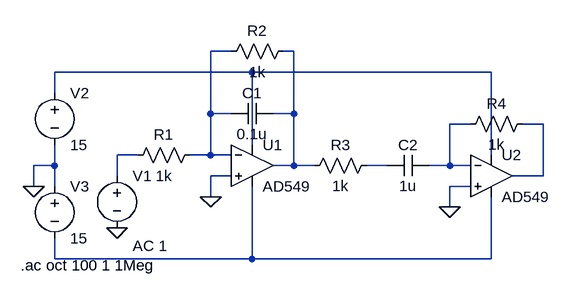
[diagram p0: schematic BandPassFilter2.asc]
BandPassFilter2.asc, the LTspice schematic file:
Version 4
SHEET 1 880 680
WIRE 240 -16 208 -16
WIRE 336 -16 320 -16
WIRE 272 16 -32 16
WIRE 640 16 272 16
WIRE -32 48 -32 16
WIRE 208 80 208 -16
WIRE 240 80 208 80
WIRE 336 80 336 -16
WIRE 336 80 304 80
WIRE 608 96 576 96
WIRE 720 96 688 96
WIRE 272 128 272 16
WIRE 96 144 64 144
WIRE 208 144 208 80
WIRE 208 144 176 144
WIRE 240 144 208 144
WIRE 640 144 640 16
WIRE -32 160 -32 128
WIRE -32 160 -64 160
WIRE 336 160 336 80
WIRE 336 160 304 160
WIRE 368 160 336 160
WIRE 480 160 448 160
WIRE 576 160 576 96
WIRE 576 160 544 160
WIRE 608 160 576 160
WIRE 64 176 64 144
WIRE 240 176 208 176
WIRE 720 176 720 96
WIRE 720 176 672 176
WIRE -64 192 -64 160
WIRE -32 192 -32 160
WIRE 608 192 576 192
WIRE 208 208 208 176
WIRE 576 224 576 192
WIRE -32 304 -32 272
WIRE 272 304 272 192
WIRE 272 304 -32 304
WIRE 640 304 640 208
WIRE 640 304 272 304
FLAG -64 192 0
FLAG 64 256 0
FLAG 208 208 0
FLAG 576 224 0
SYMBOL voltage 64 160 R0
WINDOW 123 24 124 Left 2
WINDOW 39 0 0 Left 0
SYMATTR InstName V1
SYMATTR Value ""
SYMATTR Value2 AC 1
SYMBOL voltage -32 32 R0
WINDOW 123 0 0 Left 0
WINDOW 39 0 0 Left 0
SYMATTR InstName V2
SYMATTR Value 15
SYMBOL voltage -32 176 R0
WINDOW 123 0 0 Left 0
WINDOW 39 0 0 Left 0
SYMATTR InstName V3
SYMATTR Value 15
SYMBOL Opamps\\AD549 272 96 R0
SYMATTR InstName U1
SYMBOL Opamps\\AD549 640 112 R0
SYMATTR InstName U2
SYMBOL res 192 128 R90
WINDOW 0 0 56 VBottom 2
WINDOW 3 32 56 VTop 2
SYMATTR InstName R1
SYMATTR Value 1k
SYMBOL res 336 -32 R90
WINDOW 0 0 56 VBottom 2
WINDOW 3 32 56 VTop 2
SYMATTR InstName R2
SYMATTR Value 1k
SYMBOL res 464 144 R90
WINDOW 0 0 56 VBottom 2
WINDOW 3 32 56 VTop 2
SYMATTR InstName R3
SYMATTR Value 1k
SYMBOL res 704 80 R90
WINDOW 0 0 56 VBottom 2
WINDOW 3 32 56 VTop 2
SYMATTR InstName R4
SYMATTR Value 1k
SYMBOL cap 304 64 R90
WINDOW 0 0 32 VBottom 2
WINDOW 3 32 32 VTop 2
SYMATTR InstName C1
SYMATTR Value 0.1u
SYMBOL cap 544 144 R90
WINDOW 0 0 32 VBottom 2
WINDOW 3 32 32 VTop 2
SYMATTR InstName C2
SYMATTR Value 1u
TEXT -84 314 Left 2 !.ac oct 100 1 1Meg

The netlist it stands for:
* BandPassFilter2.asc
V1 N006 0 AC 1
V2 N003 0 15
V3 0 N008 15
XU1 0 N001 N003 N008 N002 AD549  ; pins In+ In- V+ V- OUT
XU2 0 N004 N003 N008 N005 AD549  ; pins In+ In- V+ V- OUT
R1 N001 N006 1k
R2 N002 N001 1k
R3 N007 N002 1k
R4 N005 N004 1k
C1 N002 N001 0.1u
C2 N004 N007 1u
.ac oct 100 1 1Meg
.backanno
.end